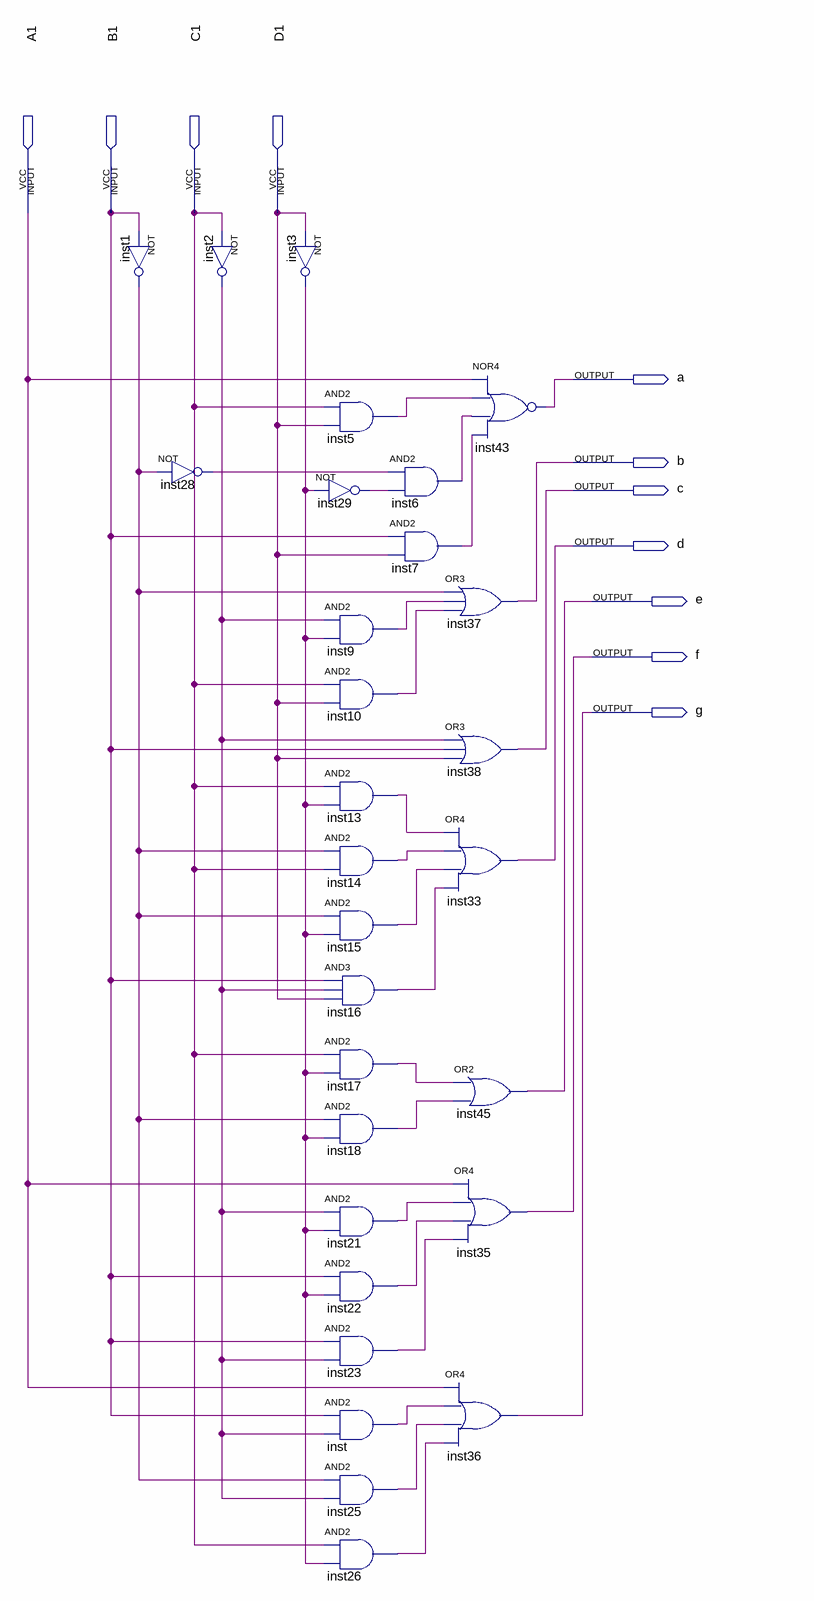
[diagram p0: schematic sheet]
// Quartus schematic sevenseg.bdf as structural Verilog: 29 symbols, 11 pins
module sevenseg (
  input  A1,
  input  B1,
  input  C1,
  input  D1,
  output a,
  output b,
  output c,
  output d,
  output e,
  output f,
  output g
);

  wire inst1_out, inst2_out, inst3_out, inst5_out, inst6_out, inst7_out, inst9_out, inst10_out, inst13_out,
       inst14_out, inst15_out, inst16_out, inst17_out, inst18_out, inst21_out, inst22_out, inst23_out,
       inst25_out, inst26_out, inst28_out, inst29_out, inst_out;

  not inst1 (inst1_out, B1);
  not inst28 (inst28_out, inst1_out);
  not inst2 (inst2_out, C1);
  not inst3 (inst3_out, D1);
  and inst5 (inst5_out, C1, D1);
  not inst29 (inst29_out, inst3_out);
  and inst9 (inst9_out, inst2_out, inst3_out);
  and inst10 (inst10_out, C1, D1);
  and inst13 (inst13_out, C1, inst3_out);
  and inst14 (inst14_out, inst1_out, C1);
  and inst15 (inst15_out, inst1_out, inst3_out);
  and inst16 (inst16_out, B1, inst2_out, D1);
  and inst17 (inst17_out, C1, inst3_out);
  and inst18 (inst18_out, inst1_out, inst3_out);
  and inst21 (inst21_out, inst2_out, inst3_out);
  and inst22 (inst22_out, B1, inst3_out);
  and inst23 (inst23_out, B1, inst2_out);
  and inst (inst_out, B1, inst2_out);
  and inst25 (inst25_out, inst1_out, inst2_out);
  and inst26 (inst26_out, C1, inst3_out);
  and inst6 (inst6_out, inst28_out, inst29_out);
  and inst7 (inst7_out, B1, D1);
  nor inst43 (a, A1, inst5_out, inst6_out, inst7_out);
  or inst37 (b, inst1_out, inst9_out, inst10_out);
  or inst38 (c, inst2_out, B1, D1);
  or inst33 (d, inst13_out, inst14_out, inst15_out, inst16_out);
  or inst45 (e, inst17_out, inst18_out);
  or inst35 (f, A1, inst21_out, inst22_out, inst23_out);
  or inst36 (g, A1, inst_out, inst25_out, inst26_out);
endmodule
